# EAGLE design AMG8854_v2 (EAGLE 9.5.0)
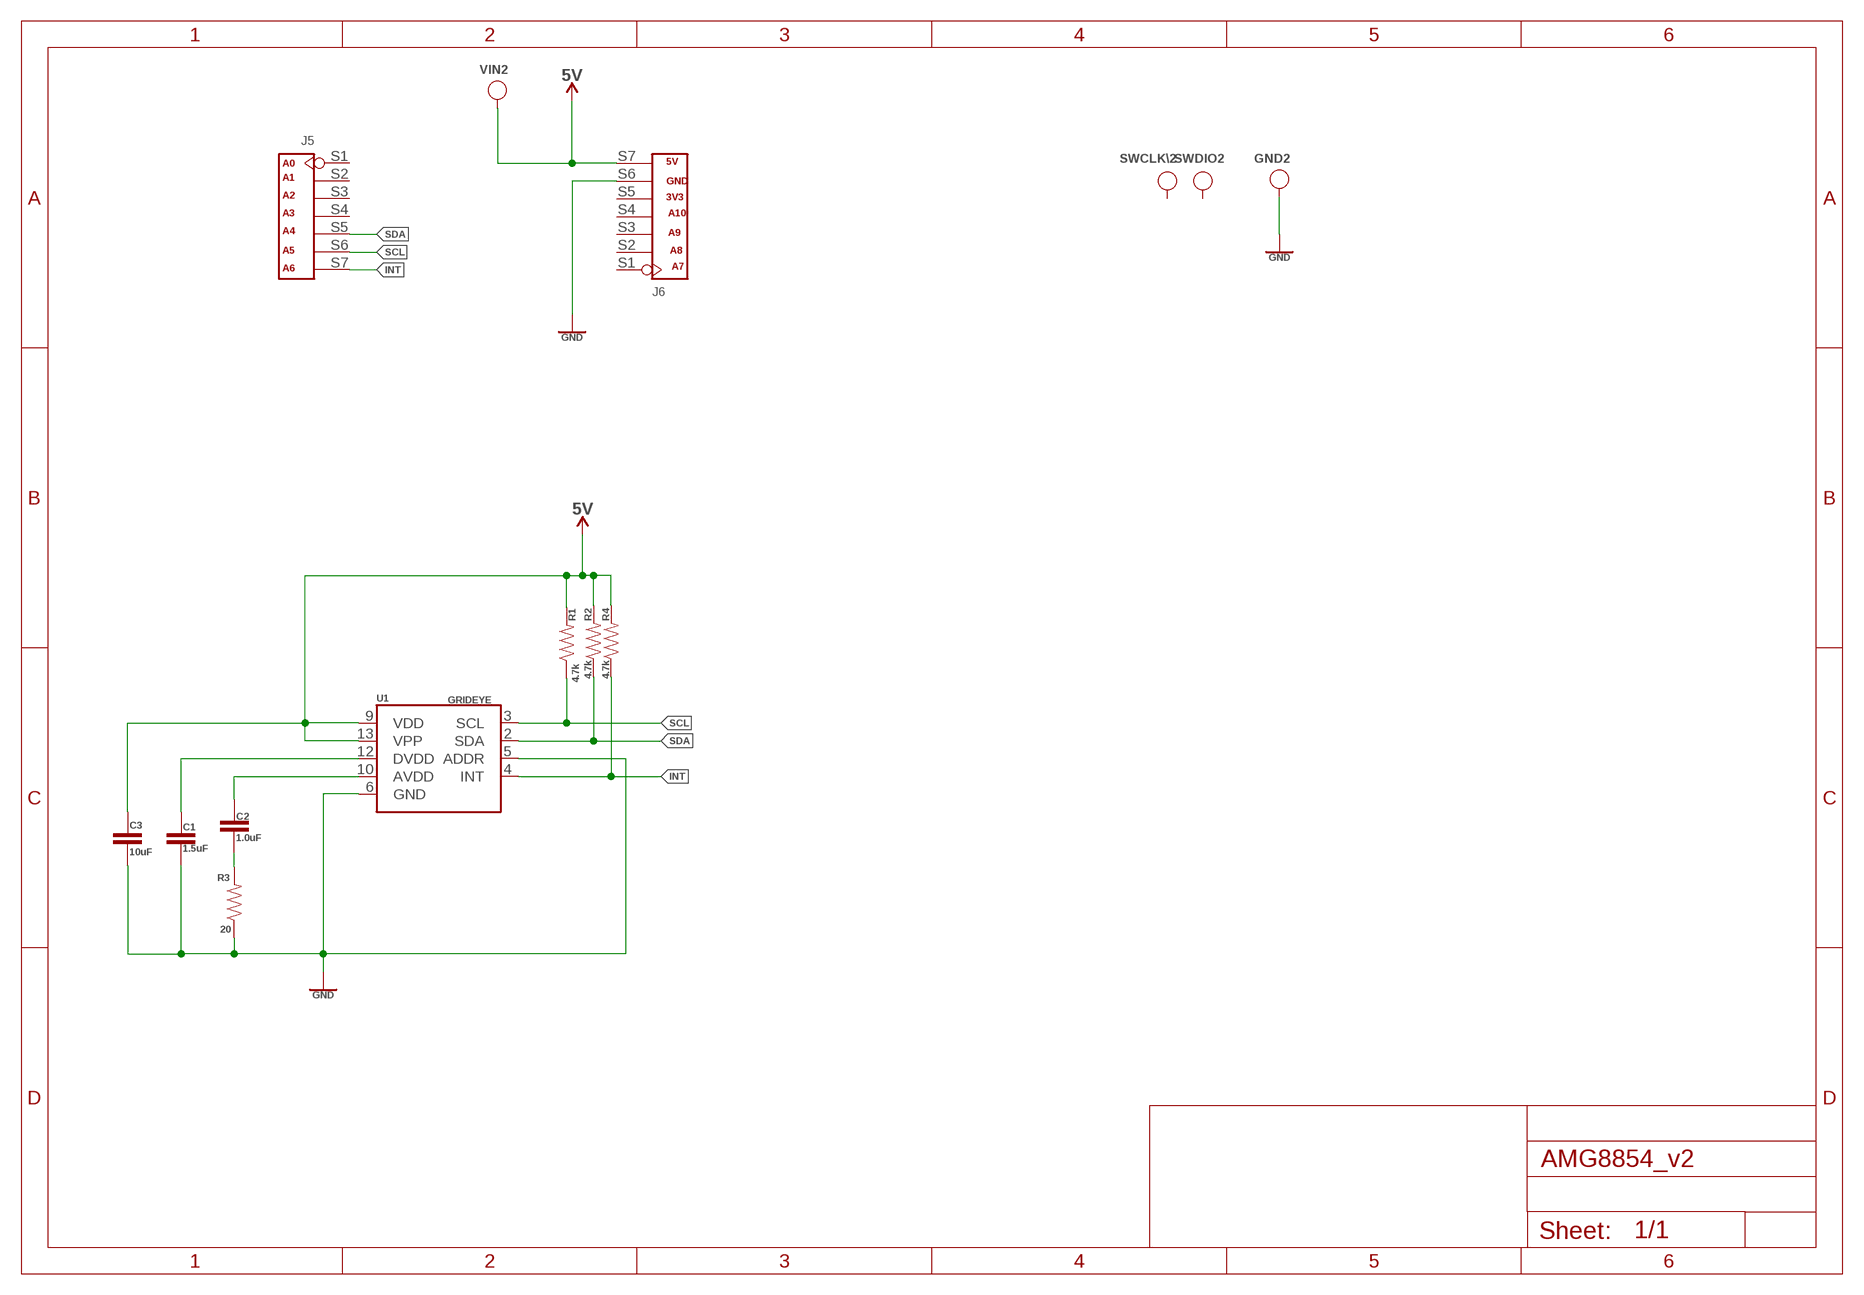
[diagram p0: schematic, sheet 1]

## Parts
C1  1.5uF  1.0UF-0603-16V-10%  [0603]
C2  1.0uF  1.0UF-0603-16V-10%  [0603]
C3  10uF  10UF-0603-6.3V-20%  [0603]
GND2  TEST-POINT'4080'  [TP-80X40MIL]
J5  DNP  CONNECTOR-NEW_HEADER-7P-HALF-HOLE  [CONNECTOR-V2]
J6  DNP  CONNECTOR-NEW_HEADER-7P-HALF-HOLE  [CONNECTOR-V2]
R1  4.7k  4.7KOHM-0603-1/10W-1%  [0603]
R2  4.7k  4.7KOHM-0603-1/10W-1%  [0603]
R3  20  20OHM-0603-1/10W-1%  [0603]
R4  4.7k  4.7KOHM-0603-1/10W-1%  [0603]
SWCLK\2  TEST-POINT'4545'  [TP-D45MIL]
SWDIO2  TEST-POINT'4545'  [TP-D45MIL]
U1  GRIDEYE  [GRIDEYE-AMG88]
VIN2  TEST-POINT'4080'  [TP-80X40MIL]

## Nets
5V: C3.1 J6.S7 R1.2 R2.2 R4.2 U1.9(VDD) U1.13(VPP) VIN2.1(T)
GND: C1.2 C3.2 GND2.1(T) J6.S6 R3.1 U1.5(ADDR) U1.6(GND)
INT: J5.S7 R4.1 U1.4(INT)
N$1: C1.1 U1.12(DVDD)
N$2: C2.2 R3.2
N$3: C2.1 U1.10(AVDD)
SCL: J5.S6 R1.1 U1.3(SCL)
SDA: J5.S5 R2.1 U1.2(SDA)
Unconnected: J5.S1 J5.S2 J5.S3 J5.S4 J6.S1 J6.S2 J6.S3 J6.S4 J6.S5 SWCLK\2.T SWDIO2.T

## Notes on the sheet
- A0 | 5V
- A1
- GND
- A2 | 3V3
- A3 | A10
- A4 | A9
- A5 | A8
- A6 | A7

## Library data of the parts
C1 = SparkFun-Capacitors:1.0UF: 1µF ceramic capacitors A capacitor is a passive two-terminal electrical component used to store electrical energy temporarily in an electric field.; PROD_ID: CAP-00868; VALUE: 1.0uF
C2 = SparkFun-Capacitors:1.0UF: 1µF ceramic capacitors A capacitor is a passive two-terminal electrical component used to store electrical energy temporarily in an electric field.; PROD_ID: CAP-00868
C3 = SparkFun-Capacitors:10UF: 10.0µF ceramic capacitors A capacitor is a passive two-terminal electrical component used to store electrical energy temporarily in an electric field.; PROD_ID: CAP-11015
GND2 VIN2 = Discrete-new:TEST-POINT
J5 J6 = Seeeduino XIAO_v1.0_191112:CONNECTOR-NEW_HEADER-7P-HALF-HOLE
R1 R2 R4 = SparkFun-Resistors:4.7KOHM: 4.7kΩ resistor A resistor is a passive two-terminal electrical component that implements electrical resistance as a circuit element. Resistors act to reduce current flow, and, at the same time, act to lower voltage levels within circuits. - Wikipedia; PROD_ID: RES-07857
R3 = SparkFun-Resistors:20OHM: RES-07862; PROD_ID: RES-07862
SWCLK\2 SWDIO2 = Discrete-new:TEST-POINT; PARTNO: DNP
U1 = Grideye:GRIDEYE

## Board
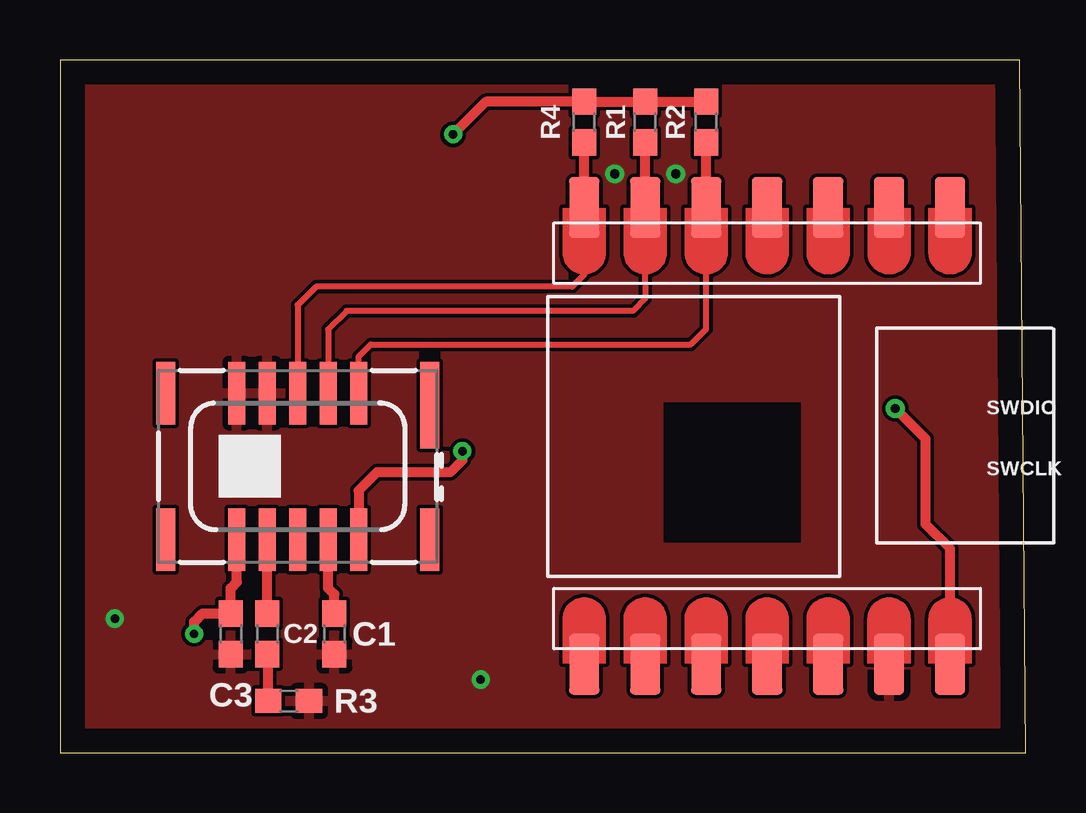
[diagram p1: board, top side]
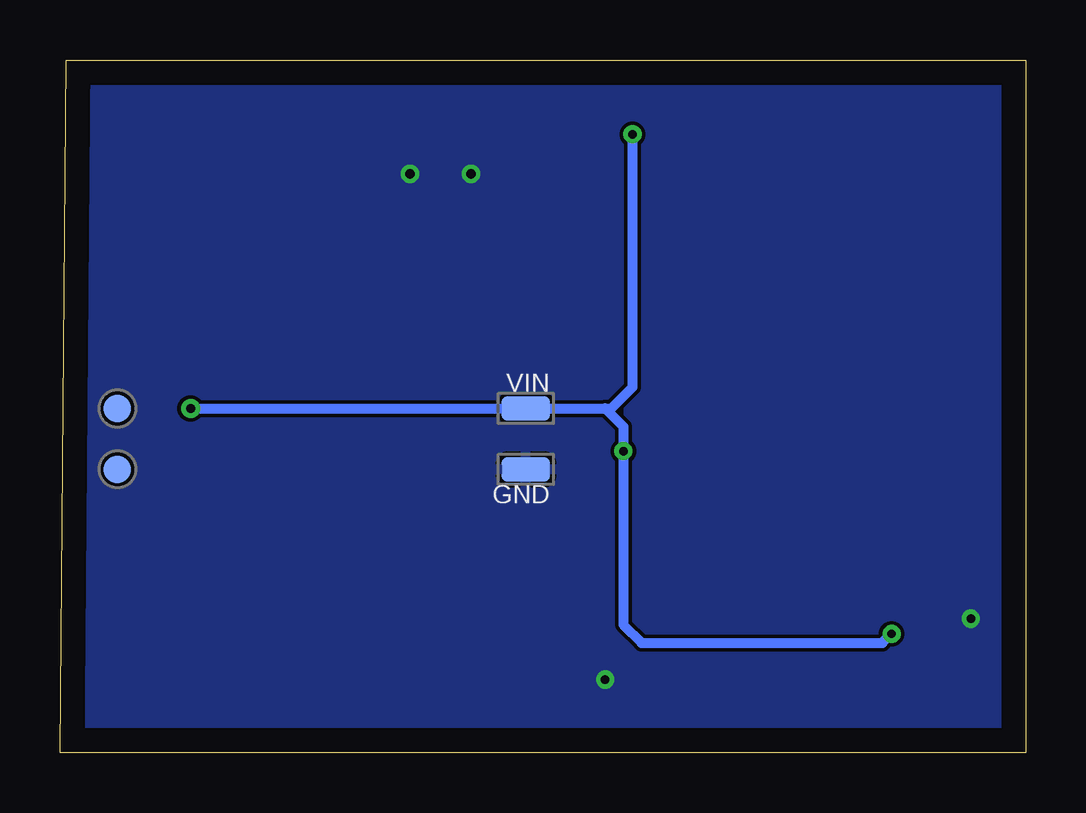
[diagram p2: board, bottom side, seen from below]

Size 40.24 x 28.88 mm. Coordinates in mm from the lower left corner, seen from the top.
Outline: 0,0 40.24,0 39.98,28.88 0,28.88 0,0
Copper layers (1*16): Top 0.035mm / dielectric 1.5mm / Bottom 0.035mm
Design rules "default": minimum track width 6mil, minimum drill 0.35mm, track to track 6mil, track to pad 6mil, pad to pad 6mil, via to via 6mil, smd to smd 6mil, copper to edge 40mil, drill to drill 6mil, minimum pad ring 10mil, minimum via ring 8mil, stop-mask expansion 4mil, vias tented up to drill 0mil, thermal gap 10mil
tRestrict: area 25.1,8.8 to 30.9,14.6

### Footprints (pad centres in the part's own frame; a part is rotated, then mirrored left to right if it is on the bottom)
0603 = smd 1.1 x 1: 1 -0.85,0; 2 0.85,0
TP-80X40MIL = smd 2.032 x 1.016: 1 0,0
CONNECTOR-V2 = smd 2.54 x 1.27: S1 -1.905,7.62; S2 -1.905,5.08; S3 -1.905,2.54; S4 -1.905,0; S5 -1.905,-2.54; S6 -1.905,-5.08; S7 -1.905,-7.62
TP-D45MIL = smd 1.143 x 1.143: T 0,0
GRIDEYE-AMG88 = smd 0.8 x 3.6: 1 -5.5,-2.55 | smd 0.7 x 2.6: 2 -2.54,-3.05; 3 -1.27,-3.05; 4 0,-3.05; 5 1.27,-3.05; 6 2.54,-3.05; 9 2.54,3.05; 10 1.27,3.05; 11 0,3.05; 12 -1.27,3.05; 13 -2.54,3.05 | smd 0.8 x 2.6: 7 5.5,-3.05; 8 5.5,3.05; 14 -5.5,3.05

### Placement (x,y rotation side)
C1  11.43,4.95 270 top
C2  8.64,4.95 270 top
C3  7.11,4.95 270 top
GND2  20.83,11.81 0 bottom
J5  29.46,20.83 270 top
J6  29.46,5.59 90 top
R1  24.38,26.29 90 top
R2  26.92,26.29 90 top
R3  9.53,2.16 180 top
R4  21.84,26.29 90 top
SWCLK\2  37.85,11.81 0 bottom
SWDIO2  37.85,14.35 0 bottom
U1  9.91,11.94 180 top
VIN2  20.83,14.35 180 bottom

### Tracks (layer width: path | path; a pad name or v marks a point on that pad's centre or on a via)
5V  (via drill 0.35, 0.38)
  Top 0.406: R2.2 R1.2 R4.2 17.74,27.14 v16.38,25.78 | J6.S7 37.08,8.51 36.07,9.53 36.07,13.08 v34.8,14.35 | U1.9 7.37,7.11 7.11,6.86 C3.1 5.93,5.8 5.59,5.46 v5.59,4.95 | v16.76,12.57 16.76,12.19 16.26,11.68 13.21,11.68 12.45,10.92 U1.13
  Bottom 0.406: v34.8,14.35 VIN2.1 17.53,14.35 | 17.53,14.35 17.27,14.35 16.38,15.24 v16.38,25.78 | 17.53,14.35 16.76,13.59 v16.76,12.57 16.76,5.33 16,4.57 5.97,4.57 v5.59,4.95
GND  (via drill 0.35, 0.38)
  other vias: 23.11,24.13 25.65,24.13 17.53,3.05 2.29,5.59
  pour Top: -0.25,0.51 -0.25,28.96 40.13,28.96 40.13,0 36.58,0 -0.25,0
  pour Bottom: 0.13,0 40.01,0 40.01,28.83 -0.25,28.83 -0.25,0.51
INT
  Top 0.254: J5.S7 21.84,19.94 21.34,19.43 10.67,19.43 9.91,18.67 U1.4
  Top 0.406: J5.S7 R4.1
N$1
  Top 0.406: C1.1 11.43,6.6 11.18,6.86 U1.12
N$2
  Top 0.406: R3.2 8.68,4.06 C2.2
N$3
  Top 0.406: C2.1 U1.10
SCL
  Top 0.254: J5.S6 24.38,19.56 24.38,18.92 23.88,18.41 11.94,18.41 11.18,17.65 U1.3
  Top 0.406: J5.S6 R1.1
SDA
  Top 0.254: U1.2 12.45,16.51 12.95,17.02 26.29,17.02 26.92,17.65 J5.S5
  Top 0.406: J5.S5 R2.1

### Text on the board
tNames: SWDIO | SWCLK
bNames: VIN | GND
tTest: J4